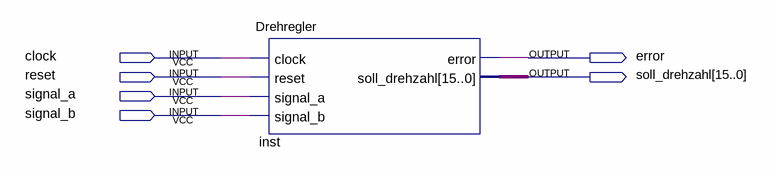
[diagram p0: schematic sheet]
// Quartus schematic test_drehregler.bdf as structural Verilog: 1 symbols, 6 pins
module test_drehregler (
  input  clock,
  input  reset,
  input  signal_a,
  input  signal_b,
  output error,
  output [15:0] soll_drehzahl
);

  Drehregler inst (
    .clock(clock), .reset(reset), .signal_a(signal_a), .signal_b(signal_b), .error(error),
    .soll_drehzahl(soll_drehzahl));
endmodule
